# EAGLE schematic source_eagle (EAGLE 9.6.2)
AUTHOR: K. TOWNSEND
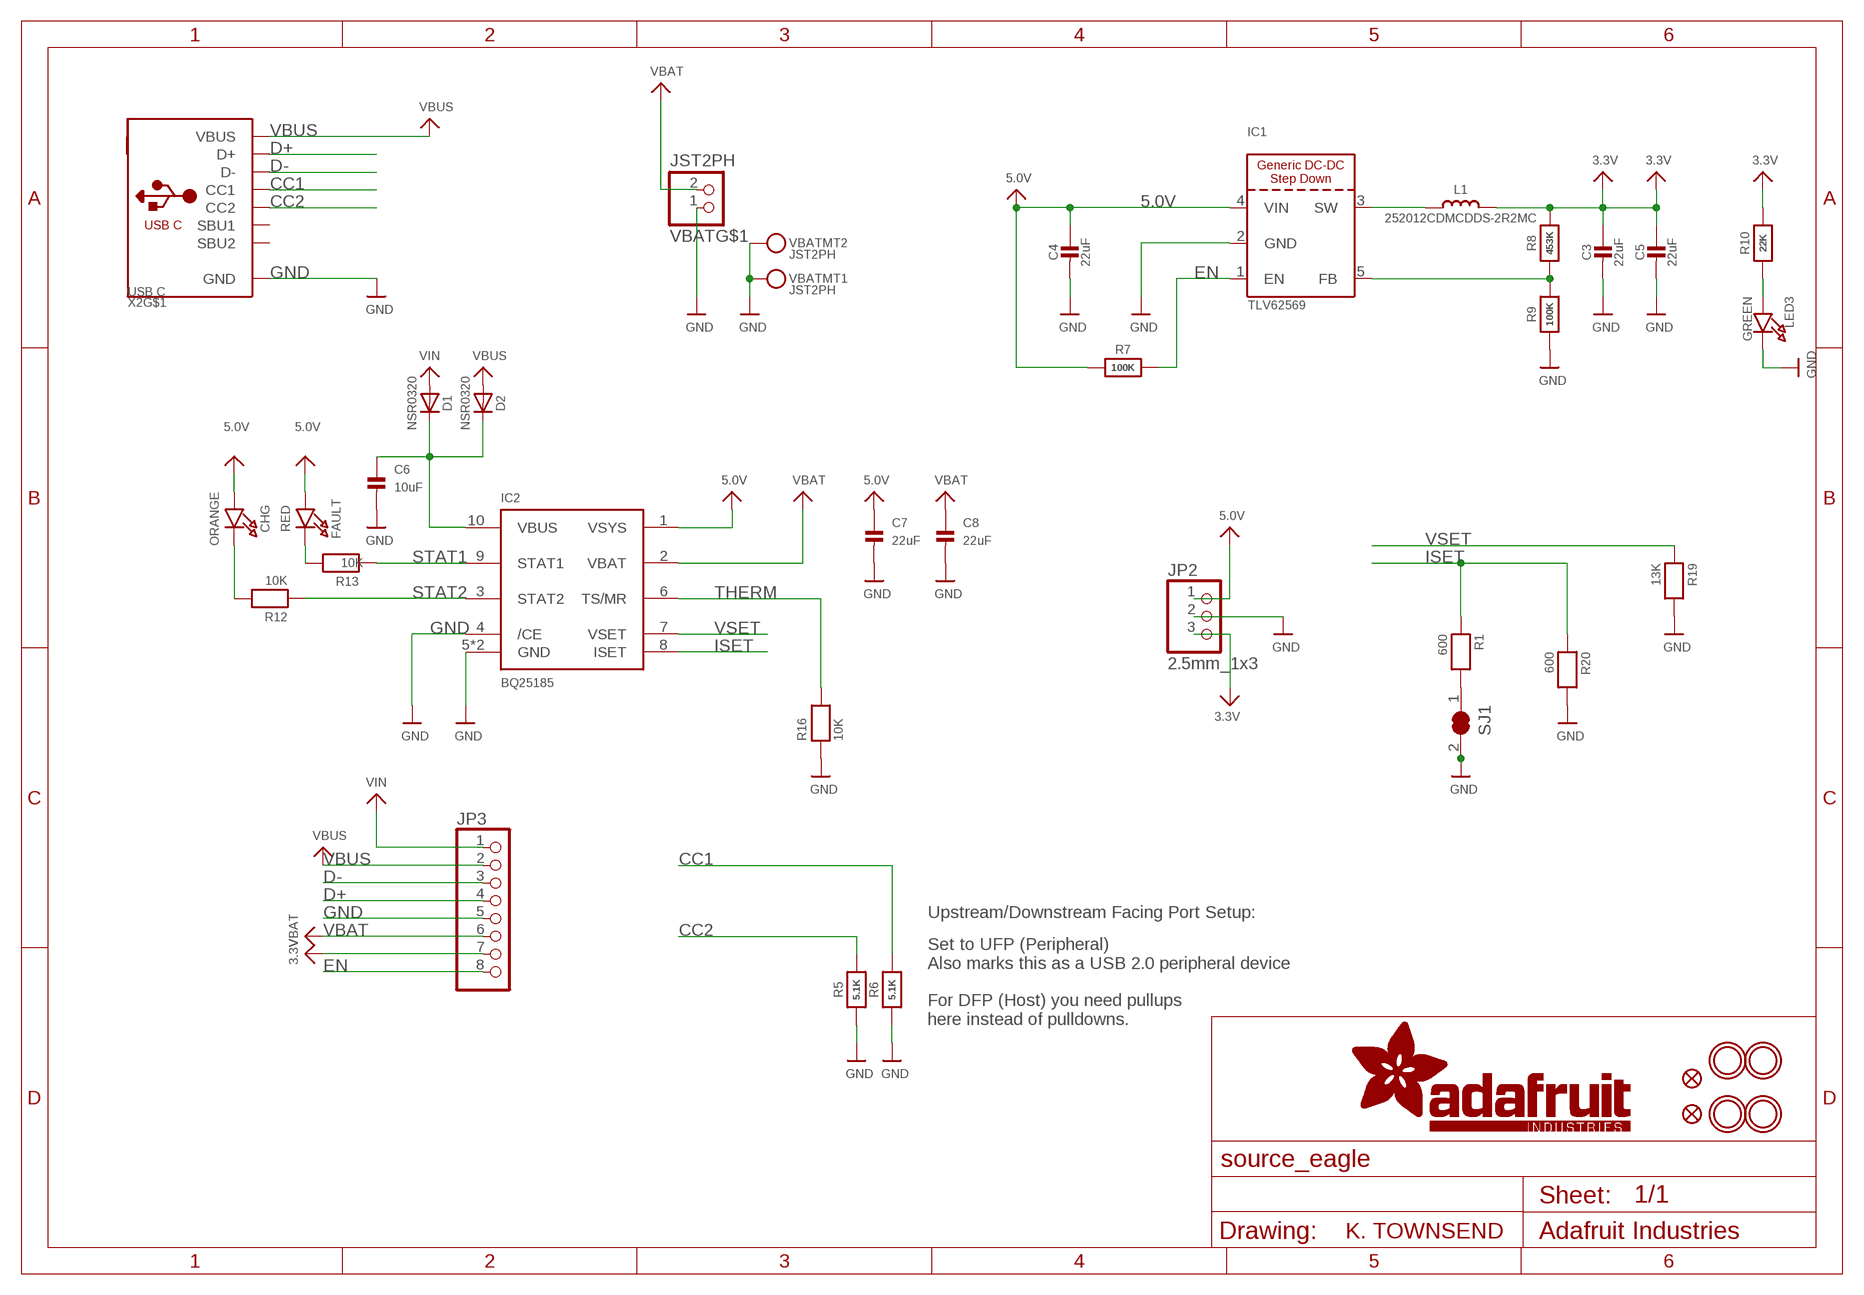
[diagram p0: schematic, sheet 1]

## Parts
C3  22uF  CAP_CERAMIC0805-NOOUTLINE  [0805-NO]
C4  22uF  CAP_CERAMIC0805-NOOUTLINE  [0805-NO]
C5  22uF  CAP_CERAMIC0805-NOOUTLINE  [0805-NO]
C6  10uF  CAP_CERAMIC0805-NOOUTLINE  [0805-NO]
C7  22uF  CAP_CERAMIC0805-NOOUTLINE  [0805-NO]
C8  22uF  CAP_CERAMIC0805-NOOUTLINE  [0805-NO]
CHG  ORANGE  LED0603_NOOUTLINE  [CHIPLED_0603_NOOUTLINE]
D1  NSR0320  DIODE_SOD323MINI  [SOD-323_MINI]
D2  NSR0320  DIODE_SOD323MINI  [SOD-323_MINI]
FAULT  RED  LED0603_NOOUTLINE  [CHIPLED_0603_NOOUTLINE]
FID1  FIDUCIAL_0.5MM  [FIDUCIAL_0.5MM]
FID2  FIDUCIAL_0.5MM  [FIDUCIAL_0.5MM]
IC1  TLV62569  VREG_BUCK_5PIN_AP3429/A  [SOT23-5]
IC2  BQ25185  [WSON10]
JP2  2.5mm_1x3  HEADER-1X3_254TERM  [1X03_2.54MMTERMINAL]
JP3  HEADER-1X870MIL  [1X08_ROUND_70]
L1  252012CDMCDDS-2R2MC  INDUCTORNRH2412T  [INDUCTOR_TAIYOYUDEN_NRH2412T]
LED3  GREEN  LED0603_NOOUTLINE  [CHIPLED_0603_NOOUTLINE]
R1  600  RESISTOR_0402NO  [_0402NO]
R5  5.1K  RESISTOR_0402NO  [_0402NO]
R6  5.1K  RESISTOR_0402NO  [_0402NO]
R7  100K  RESISTOR_0402NO  [_0402NO]
R8  453K  RESISTOR_0402NO  [_0402NO]
R9  100K  RESISTOR_0402NO  [_0402NO]
R10  22K  RESISTOR_0402NO  [_0402NO]
R12  10K  RESISTOR_0402NO  [_0402NO]
R13  10K  RESISTOR_0402NO  [_0402NO]
R16  10K  RESISTOR_0402NO  [_0402NO]
R19  13K  RESISTOR_0402NO  [_0402NO]
R20  600  RESISTOR_0402NO  [_0402NO]
SJ1  SOLDERJUMPER_CLOSED  [SOLDERJUMPER_CLOSEDWIRE]
U$9  MOUNTINGHOLE2.5  [MOUNTINGHOLE_2.5_PLATED]
U$10  MOUNTINGHOLE2.5  [MOUNTINGHOLE_2.5_PLATED]
U$11  MOUNTINGHOLE2.5  [MOUNTINGHOLE_2.5_PLATED]
U$12  MOUNTINGHOLE2.5  [MOUNTINGHOLE_2.5_PLATED]
VBAT  JST2PH  CON_JST_PH_2PIN_MT_BATT  [JSTPH2_BATT]
X2  USB C  USB_C  [USB_C_CUSB31-CFM2AX-01-X]

## Nets
3.3V: C3.1 C5.1 JP2.3 JP3.7 L1.2 R8.2 R10.2
5.0V: C4.1 C7.1 CHG.A FAULT.A IC1.4(VIN) IC2.1(VSYS) JP2.1 R7.1
CC1: R6.2 X2.A5(CC1)
CC2: R5.2 X2.B5(CC2)
D+: JP3.4 X2.A6(D+) X2.B6(D+)
D-: JP3.3 X2.A7(D-) X2.B7(D-)
EN: IC1.1(EN) JP3.8 R7.2
FB: IC1.5(FB) R8.1 R9.2
GND: C3.2 C4.2 C5.2 C6.2 C7.2 C8.2 IC1.2(GND) IC2.4(/CE) IC2.5(GND) IC2.PAD(GND) JP2.2 JP3.5 LED3.C R5.1 R6.1 R9.1 R16.1 R19.2 R20.2 SJ1.2 VBAT.1 VBAT.NC1 VBAT.NC2 X2.A1B12(GND) X2.B1A12(GND)
ISET: IC2.8(ISET) R1.1 R20.1
N$1: R1.2 SJ1.1
N$2 [power]: C6.1 D1.C D2.C IC2.10(VBUS)
N$4: IC1.3(SW) L1.1
N$7: CHG.C R12.2
N$8: LED3.A R10.1
N$9: FAULT.C R13.2
STAT1: IC2.9(STAT1) R13.1
STAT2: IC2.3(STAT2) R12.1
THERM: IC2.6(TS/MR) R16.2
VBAT: C8.1 IC2.2(VBAT) JP3.6 VBAT.2
VBUS [power]: D2.A JP3.2 X2.A4B9(VBUS) X2.B4A9(VBUS)
VIN: D1.A JP3.1
VSET: IC2.7(VSET) R19.1
Unconnected: X2.A8(SBU1) X2.B8(SBU2) X2.M1(MT) X2.M2(MT) X2.M3(MT) X2.M4(MT)

## Notes on the sheet
- Upstream/Downstream Facing Port Setup:
- Set to UFP (Peripheral)
  Also marks this as a USB 2.0 peripheral device
  
  For DFP (Host) you need pullups
  here instead of pulldowns.

## Library data of the parts
C3-C8 = microbuilder:CAP_CERAMIC: Ceramic Capacitors For new designs, use the packages preceded by an '_' character since they are more reliable: The following footprints should be used on most boards: _0402 - Standard footprint for regular board layouts _0603 - Standard footprint for regular board layouts _0805 - Standard footprint for regular board layouts _1206 - Standard footprint for regular board layouts For extremely tight-pitch boards where space is at a premium, the following 'micro-pitch' footprints can be used (smaller pads, no silkscreen outline, etc.): _0402MP - Micro-pitch footprint for very dense/compact boards _0603MP - Micro-pitch footprint for very dense/compact boards _0805MP - Micro-pitch footprint for very dense/compact boards _1206MP - Micro-pitch footprint for very dense/compact boards
CHG FAULT LED3 = microbuilder:LED: LED 0603 - 0603 Surface Mount Package 2mA: Green LED - Low Power (3.9mcd, 2ma, 1.7Vf) - Digikey: 475-2709-2-ND Orange LED - Low Power (9.8mcd, 2ma, 1.8Vf) - Digikey: 475-1194-2-ND Red LED - Low Power (5mcd, 2ma, 1.8Vf) - Digikey: 475-1195-2-ND Yellow LED - Low Power (7mcd, 2ma, 1.8Vf) - Digikey: 475-1196-2-ND 5mA: Blue LED - Low Power (17mcd, 5ma, 2.9Vf) - Digikey: LNJ937W8CRACT-ND 0805 - 0805 Surface Mount Package 2mA: Red LED (8.8mcd, 2mA, 1.8Vf, Clear) - Low Power [Digikey: 475-2510-1-ND] Green LED (5mcd, 2mA, 1.8Vf, Clear) - Low Power [Digikey: 475-2730-1-ND] Yellow LED (11.3mcd, 2mA, 1.8Vf, Clear) - Low Power [Digikey: 475-2555-1-ND] 20mA: Red LED (104mcd, 20mA, Diffused) - LS R976 [Digikey: 475-1278-6-ND] Red LED (12mcd, 20mA, 2.0Vf, Clear) - APT2012EC [Digikey: 754-1128-1-ND] Green LED (15mcd, 20mA, 2.2Vf, Clear) - APT2012GC [Digikey: 754-1131-1-ND] Orange LED (160mcd, 20mA, 2.1Vf, Clear) - APT2012SECK [Digikey: 754-1130-1-ND] 1206 - 1206 Surface Mount Package Green LED (26mcd, 20mA, Diffused) - LG N971 [Digikey: 475-1407-6-ND] Red LED (15mcd, 20mA, Diffused) - LH N974 [Digikey: 475-1416-6-ND] Cree - Cree High-Power Surface Mount LEDs XPEBWT-L1-0000-00D50 - White 111lm 350mA 2.9Vf 6200K 110° XTEAWT-00-0000-00000LEE3 - White 114lm 350mA 2.85Vf 5000K 115° Everlight - Everlight 45-21 Series Surface Mount LEDs 45-21/QK2C-B2832AC2CB2/2T - Warm White 2000mcd 20mA 3.25Vf 3050K 120° 45-21/LK2C-B38452C4CB2/2T - Nuetral White 2000mcd 20mA 3.25Vf 4150K 120° 45-21/LK2C-B50634C6CB2/2T - Cold White 2200mcd 20mA 3.25Vf 5650K 120° PLCC2 Reverse Mount LS T77K-J1L2-1-0-2-R18-Z - Red 11.25mcd 2mA 1.8Vf 630nm 120° LO T77K-L1M2-24-Z - Orange 19.6mcd 2mA 1.8Vf 606nm 120° LY T77K-K2M1-26-Z - Yellow 15.7mcd 2mA 1.8Vf 587nm 120°; ROT: 270
D1 D2 = microbuilder:DIODE: Diode SMA Model Volts Amps Type Vf Ir Digikey # Notes SSA34-E3 40V 3A Schottky 480mV @ 3A 200uA @ 40V SSA34-E3/61TGITR-ND CDBA120-G 20V 1A Schottky 500mV @ 1A 500uA @ 20V 641-1014-6-ND REEL MBRA210 10V 2A Schottky 350mV @ 2A 700uA @ 10V MBRA210LT3 SOD-123 Model Volts Amps Type Vf Ir Order # Notes BAT54T1G 30V 200mA Schottky 800mV @ 200mA 2uA @ 25V BAT54T1GOSTR-ND B0530W 30V 500mA Schottky 430mV @ 500mA 130uA @ 30V B0530W-FDICT-ND REEL MBR120 20V 1A Schottky 340mV @ 1A MBR120VLSFT1GOSCT-ND SOD-323 Model Volts Amps Type Vf Ir Order # Notes PMEG2005EJ 20V 500mA Schottky 355mV @ 500mA 568-4110-1-ND ZLLS410 10V 570mA Schottky 380mV @ 570mA ZLLS410CT-ND 1N4148WS 75V 150mA Silicon/Simple 1V 1N4148WSFSCT-ND REEL SOD-523 Model Volts Amps Type Vf Ir Order # Notes BAT54XV2 30V 200mA Schottky 0.8V @ 100mA BAT54XV2CT-ND TB751S 30V 30mA Schottky RB751S-40TE61CT-ND SOT23-R/W (R = Solder Paste/Reflow Ovens, W = Hand-Soldering) Model Volts Amps Type Vf Ir Order # Notes BAT54FILM 40V 300mA Schottky 497-7162-1-ND POWERDI-5 Model Volts Amps Type Vf Ir Order # Notes PDS560 60V 5A Schottky 670mV @ 5A 150uA @ 60V PDS560DICT-ND
FID1 FID2 = microbuilder:FIDUCIAL: Fiducial Alignment Points Various fiducial points for machine vision alignment.
IC1 = adafruit_power:VREG_BUCK_5PIN
IC2 = microbuilder:BQ25185
JP2 = microbuilder:HEADER-1X3: PIN HEADER; FORCETHM: 1
JP3 = microbuilder:HEADER-1X8: PIN HEADER
L1 = microbuilder:INDUCTOR: Inductors 0603: 10nH Ceramic Inductor - microwire antenna/RF (Digikey: 712-1434-2-ND) 0805: 560nH Ceramic Inductor - RF (Digikey: 553-1047-1-ND) 270nH Ceramic Inductor - Q = 40@250MHz, +-5%, 1 Ohm DC Resistance (Digikey: 535-10506-2-ND) 1007 (2518 Metric) SMT: 10µH 10% 250mOhm 820mA 1007 Inductor (Digikey: 587-2189-1-ND) 22µH 10% 500mOhm 580mA 1007 Inductor (Digikey: 587-2190-1-ND) 47µH 10% 950mOhm 420mA 1007 Inductor (Digikey: 587-2191-1-ND) 47µH 5% 100mOhm 1A 1008 Inductor (Digikey: 732-1816-1-ND) 5.0x5.0mm (Taiyo Yuden NR5040 Series) 6.8µH 20% 2.3A 64mOhm Inductor (Digikey: 587-2374-2-ND) 5.0x5.0mm (TDK VLC5045 Series) 4.7µH 20% 3.3A 34mOhm Inductor (Digikey: 445-6526-1-ND) 6.8µH 20% 2.7A 46mOhm Inductor (Digikey: 445-6527-1-ND) 6.0x6.0mm (TDK VLC6045 Series) 4.7µH 20% 3.8A 27mOhm Inductor (Digikey: 445-6538-2-ND) 6.8µH 20% 3A 41mOhm Inductor (Digikey: 445-6540-1-ND) 6.2µH 30% 2.2A 45mOhm Inductor (Digikey: SRR5028-6R2YCT-ND) - Not TDK VLC6045 but footprint should match 6.0x6.0mm (TDK SLF6045 Series) 6.8uH 30% 2A 33mOhm Inductor (Digikey: 445-4572-1-ND, Mouser: 810-SLF645T6R8N2R0PF) 6.0x6.0mm (Sumida CDRH5D28 Series) 6.2uH 30% 1.8A 45mOhm Inductor (Digikey: 308-1542-1-ND) Taiyo Yuden NR3015T2R2M - 2.2uH 20% 1.5A (Digikey: 587-1648-2-ND, Mouser: 963-NR3015T2R2M) - Used with TI TPS62172 CoilCraft RFID Transponder Coil - MA5532-AE (For use with AS3935 Lightning Sensor) Taiyo Yuden NRH2412T2R2MNGH - 2.2uH 20% 1AA (Digikey: 587-3443-1-ND) - Used with TI LM3671 Vishay IHLP 1.0uH Molded Inductor - 24mOhm DCR, 5A, +/-20%, -55°C-125°C (Digikey: 541-1319-1-ND)
R1 R5-R10 R12 R13 R16 R19 R20 = microbuilder:RESISTOR: Resistors For new designs, use the packages preceded by an '_' character since they are more reliable: The following footprints should be used on most boards: _0402 - Standard footprint for regular board layouts _0603 - Standard footprint for regular board layouts _0805 - Standard footprint for regular board layouts _1206 - Standard footprint for regular board layouts For extremely tight-pitch boards where space is at a premium, the following 'micro-pitch' footprints can be used (smaller pads, no silkscreen outline, etc.): _0402MP - Micro-pitch footprint for very dense/compact boards _0603MP - Micro-pitch footprint for very dense/compact boards _0805MP - Micro-pitch footprint for very dense/compact boards _1206MP - Micro-pitch footprint for very dense/compact boards
SJ1 = microbuilder:SOLDERJUMPER_CLOSED: Solder Jumper - Closed These solder jumpers are closed by default CLOSEDWIRE - 10 mil trace between pads that can be cut and resoldered later CLOSEDPERM - 63 mil trace between pads for a permanent connection (used to 'bridge' two signals, a shameless hack for Eagle). Can double as a test point as well (no cream layer)
U$9-U$12 = adafruit_electromech:MOUNTINGHOLE: Mounting Hole For #2 screws (0.086"/2.18mm width, 0.094"/2.4mm hole) use 2.5mm; BOM: EXCLUDE
VBAT = adafruit_electromech:CON_JST_PH_2PIN_MT; LCSC: C47647
X2 = adafruit_electromech:USB_C: USB Type-C USB 2.0 Connector; LCSC: C165948

## Net classes
1 power: width 0.305 mm, drill 0.381 mm